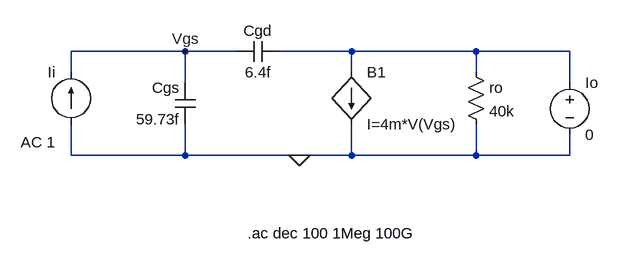
[diagram p0: schematic MOSFET.asc]
MOSFET.asc, the LTspice schematic file:
Version 4.1
SHEET 1 880 680
WIRE 80 128 -96 128
WIRE 160 128 80 128
WIRE 336 128 224 128
WIRE 528 128 336 128
WIRE 672 128 528 128
WIRE -96 160 -96 128
WIRE 336 160 336 128
WIRE 528 160 528 128
WIRE 80 176 80 128
WIRE 672 176 672 128
WIRE -96 288 -96 240
WIRE 80 288 80 240
WIRE 80 288 -96 288
WIRE 256 288 80 288
WIRE 336 288 336 240
WIRE 336 288 256 288
WIRE 528 288 528 240
WIRE 528 288 336 288
WIRE 672 288 672 256
WIRE 672 288 528 288
FLAG 256 288 0
FLAG 80 128 Vgs
SYMBOL cap 224 112 R90
WINDOW 0 0 32 VBottom 2
WINDOW 3 32 32 VTop 2
SYMATTR InstName Cgd
SYMATTR Value 6.4f
SYMBOL cap 96 240 R180
WINDOW 0 24 56 Left 2
WINDOW 3 24 8 Left 2
SYMATTR InstName Cgs
SYMATTR Value 59.73f
SYMBOL res 512 144 R0
SYMATTR InstName ro
SYMATTR Value 40k
SYMBOL current -96 240 R180
WINDOW 0 24 80 Left 2
WINDOW 3 24 0 Left 2
WINDOW 123 24 -28 Left 2
WINDOW 39 0 0 Left 0
SYMATTR InstName Ii
SYMATTR Value ""
SYMATTR Value2 AC 1
SYMBOL bi 336 160 R0
SYMATTR InstName B1
SYMATTR Value I=4m*V(Vgs)
SYMBOL voltage 672 160 R0
SYMATTR InstName Io
SYMATTR Value 0
TEXT 176 408 Left 2 !.ac dec 100 1Meg 100G

The netlist it stands for:
* MOSFET.asc
Cgd N001 Vgs 6.4f
Cgs 0 Vgs 59.73f
ro N001 0 40k
Ii 0 Vgs AC 1
B1 N001 0 I=4m*V(Vgs)
V§Io N001 0 0
.ac dec 100 1Meg 100G
.backanno
.end